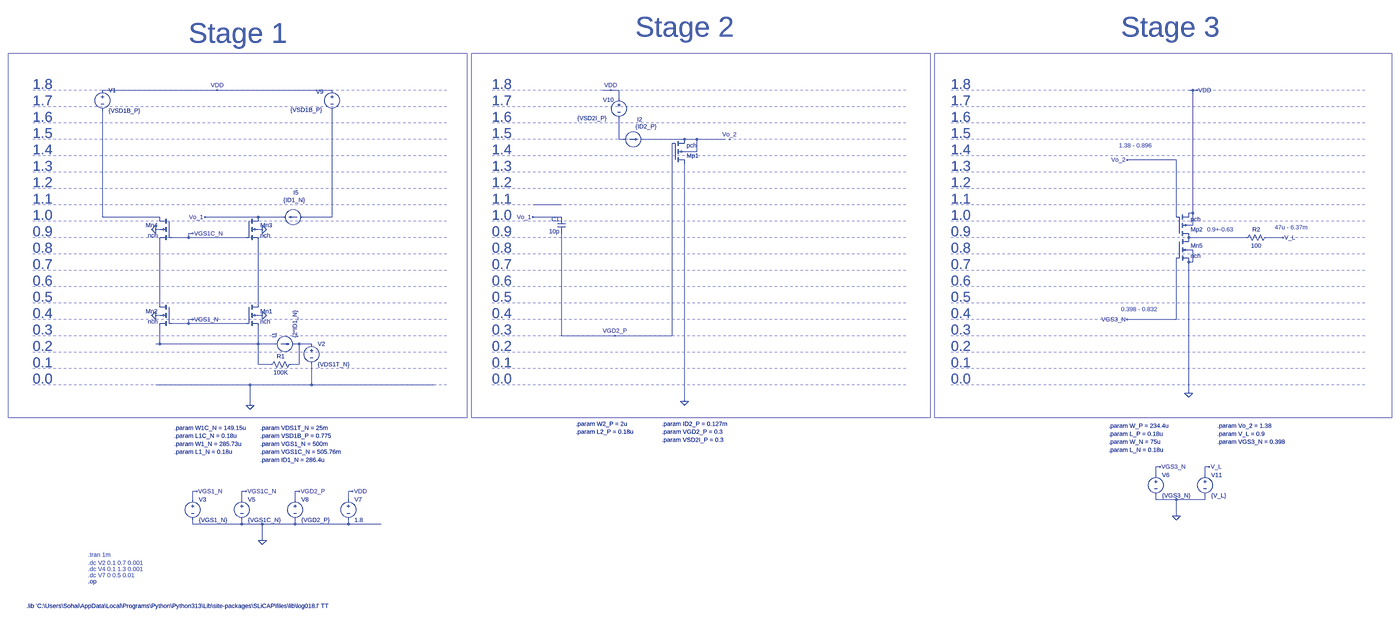
[diagram p0: schematic 1_2_final.asc, whole sheet]
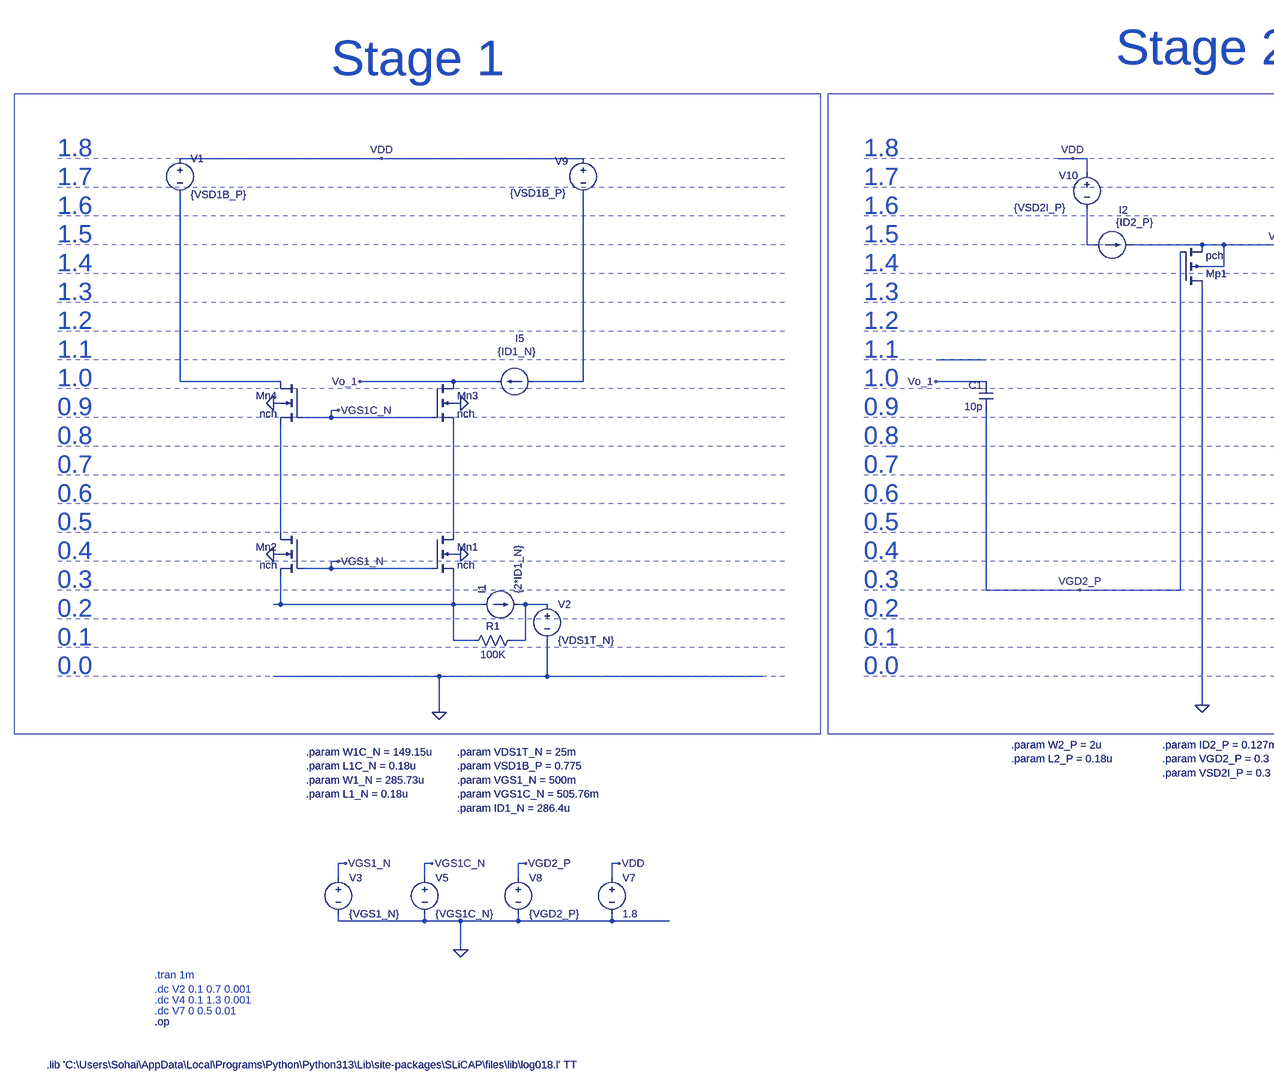
[diagram p1: schematic 1_2_final.asc, part, row 1 of 1, column 1 of 2]
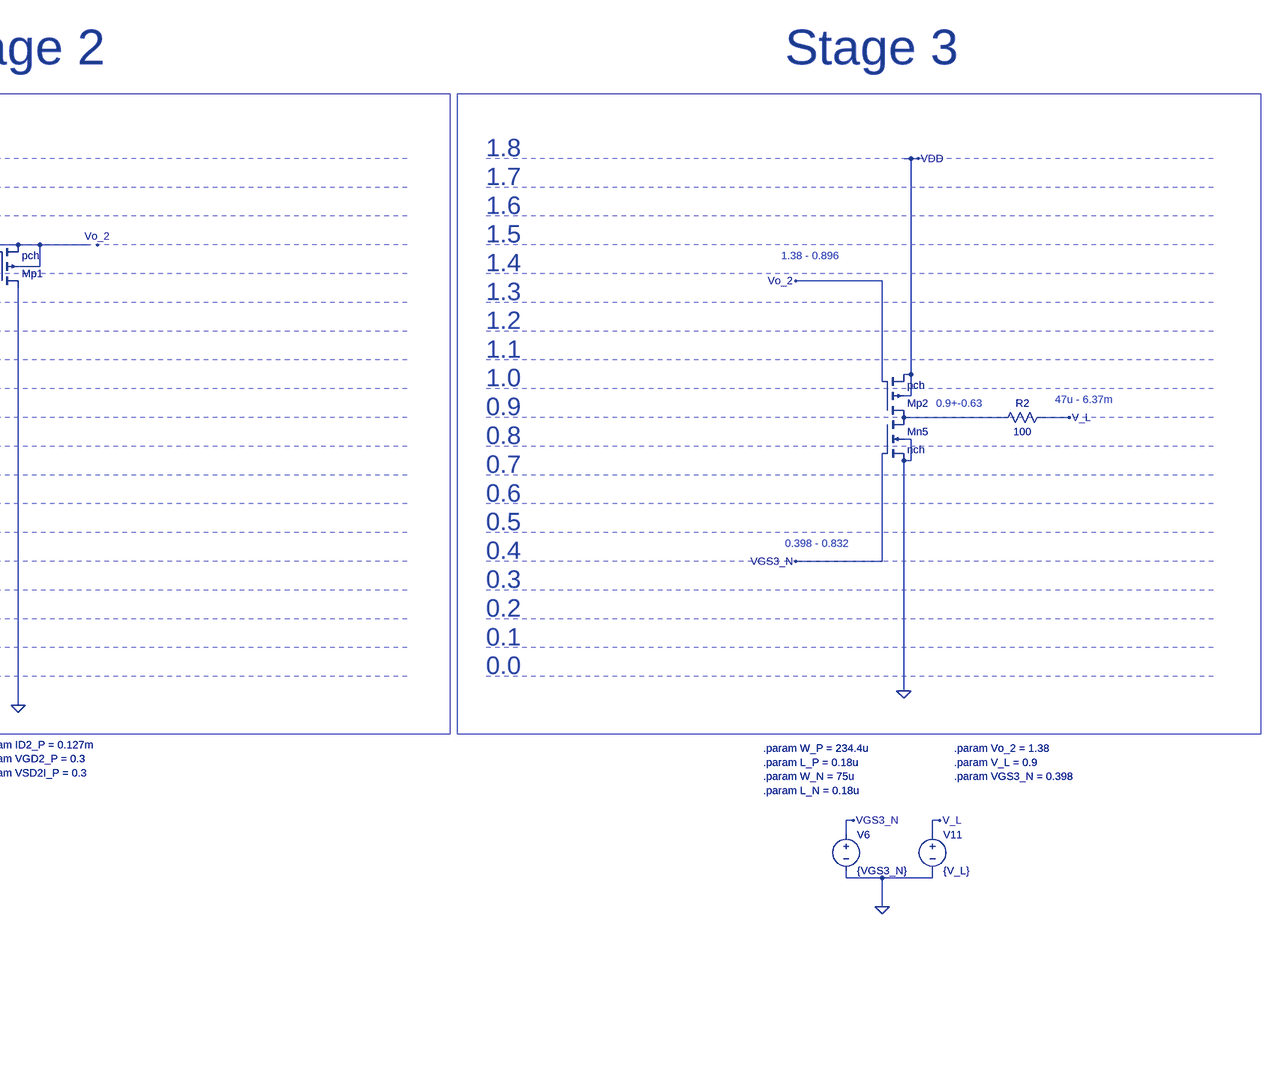
[diagram p2: schematic 1_2_final.asc, part, row 1 of 1, column 2 of 2]
1_2_final.asc, the LTspice schematic file:
Version 4
SHEET 1 2932 2468
WIRE -1664 -304 -2112 -304
WIRE -1216 -304 -1664 -304
WIRE -128 -304 -160 -304
WIRE -96 -304 -128 -304
WIRE 2144 -304 2128 -304
WIRE 2160 -304 2144 -304
WIRE -96 -272 -96 -304
WIRE -96 -112 -96 -192
WIRE -80 -112 -96 -112
WIRE 160 -112 0 -112
WIRE 208 -112 160 -112
WIRE 320 -112 208 -112
WIRE 208 -64 208 -112
WIRE 208 -64 160 -64
WIRE 2080 -32 1888 -32
WIRE -320 144 -432 144
WIRE 2144 176 2144 -304
WIRE 2144 176 2128 176
WIRE -2112 192 -2112 -224
WIRE -1888 192 -2112 192
WIRE -1504 192 -1712 192
WIRE -1408 192 -1504 192
WIRE -1216 192 -1216 -224
WIRE -1216 192 -1328 192
WIRE -320 192 -432 192
WIRE 2080 192 2080 -32
WIRE 2144 224 2144 176
WIRE 2144 224 2128 224
WIRE -1888 240 -1904 240
WIRE -1488 240 -1504 240
WIRE -1760 256 -1776 256
WIRE -1776 272 -1776 256
WIRE -1776 272 -1840 272
WIRE -1552 272 -1776 272
WIRE 2352 272 2128 272
WIRE 2496 272 2432 272
WIRE 2144 320 2128 320
WIRE 2144 368 2144 320
WIRE 2144 368 2128 368
WIRE -1888 528 -1888 288
WIRE -1504 528 -1504 288
WIRE -1888 576 -1904 576
WIRE -1488 576 -1504 576
WIRE -1760 592 -1776 592
WIRE 2080 592 2080 352
WIRE 2080 592 1888 592
WIRE -1776 608 -1776 592
WIRE -1776 608 -1840 608
WIRE -1552 608 -1776 608
WIRE -320 656 -320 256
WIRE -112 656 -320 656
WIRE 112 656 112 -96
WIRE 112 656 -112 656
WIRE -1888 688 -1888 624
WIRE -1888 688 -1904 688
WIRE -1504 688 -1504 624
WIRE -1504 688 -1888 688
WIRE -1440 688 -1504 688
WIRE -1344 688 -1360 688
WIRE -1296 688 -1344 688
WIRE -1504 768 -1504 688
WIRE -1456 768 -1504 768
WIRE -1344 768 -1344 688
WIRE -1344 768 -1376 768
WIRE -1536 848 -1904 848
WIRE -1296 848 -1296 768
WIRE -1296 848 -1536 848
WIRE -816 848 -1296 848
WIRE 2128 880 2128 368
WIRE 160 912 160 -16
WIRE -1536 928 -1536 848
WIRE 2016 1168 2000 1168
WIRE 2208 1168 2192 1168
WIRE 2000 1200 2000 1168
WIRE 2192 1200 2192 1168
WIRE -1744 1264 -1760 1264
WIRE -1552 1264 -1568 1264
WIRE -1344 1264 -1360 1264
WIRE -1136 1264 -1152 1264
WIRE -1760 1296 -1760 1264
WIRE -1568 1296 -1568 1264
WIRE -1360 1296 -1360 1264
WIRE -1152 1296 -1152 1264
WIRE 2000 1296 2000 1280
WIRE 2080 1296 2000 1296
WIRE 2192 1296 2192 1280
WIRE 2192 1296 2080 1296
WIRE 2080 1360 2080 1296
WIRE -1760 1392 -1760 1376
WIRE -1568 1392 -1568 1376
WIRE -1568 1392 -1760 1392
WIRE -1488 1392 -1568 1392
WIRE -1360 1392 -1360 1376
WIRE -1360 1392 -1488 1392
WIRE -1152 1392 -1152 1376
WIRE -1152 1392 -1360 1392
WIRE -1024 1392 -1152 1392
WIRE -1488 1456 -1488 1392
FLAG -1760 592 VGS1_N
FLAG -1760 256 VGS1C_N
FLAG -1536 928 0
FLAG -1488 1456 0
FLAG -1744 1264 VGS1_N
FLAG -1552 1264 VGS1C_N
FLAG -1136 1264 VDD
FLAG -1344 1264 VGD2_P
FLAG -1488 240 0
FLAG -1904 240 0
FLAG -1488 576 0
FLAG -1904 576 0
FLAG -128 -304 VDD
FLAG 160 912 0
FLAG -112 656 VGD2_P
FLAG -1664 -304 VDD
FLAG -1712 192 Vo_1
FLAG -432 192 Vo_1
FLAG 2080 1360 0
FLAG 2016 1168 VGS3_N
FLAG 2208 1168 V_L
FLAG 2496 272 V_L
FLAG 2160 -304 VDD
FLAG 2128 880 0
FLAG 1888 592 VGS3_N
FLAG 336 -112 Vo_2
FLAG 1888 -32 Vo_2
DATAFLAG -1632 272 ""
DATAFLAG -1632 608 ""
DATAFLAG 112 -112 ""
DATAFLAG 16 656 ""
DATAFLAG -2032 192 ""
DATAFLAG -1440 192 ""
DATAFLAG -1504 384 ""
DATAFLAG -1888 416 ""
DATAFLAG -1664 688 ""
DATAFLAG -1312 688 ""
DATAFLAG -1232 192 ""
DATAFLAG -400 192 ""
SYMBOL nmos4 -1552 528 R0
SYMATTR InstName Mn1
SYMATTR Value nch
SYMATTR Value2 l={L1_N} w={W1_N/4} m=4
SYMBOL nmos4 -1840 528 M0
SYMATTR InstName Mn2
SYMATTR Value nch
SYMATTR Value2 l={L1_N} w={W1_N/4} m=4
SYMBOL nmos4 -1552 192 R0
SYMATTR InstName Mn3
SYMATTR Value nch
SYMATTR Value2 l={L1C_N} w={W1C_N/4} m=4
SYMBOL nmos4 -1840 192 M0
SYMATTR InstName Mn4
SYMATTR Value nch
SYMATTR Value2 l={L1C_N} w={W1C_N/4} m=4
SYMBOL current -1440 688 R270
WINDOW 123 0 0 Left 0
WINDOW 39 0 0 Left 0
SYMATTR InstName I1
SYMATTR Value {2*ID1_N}
SYMBOL voltage -1296 672 R0
WINDOW 123 0 0 Left 0
WINDOW 39 0 0 Left 0
SYMATTR InstName V2
SYMATTR Value {VDS1T_N}
SYMBOL voltage -1760 1280 R0
WINDOW 123 0 0 Left 0
WINDOW 39 0 0 Left 0
SYMATTR InstName V3
SYMATTR Value {VGS1_N}
SYMBOL voltage -1568 1280 R0
WINDOW 123 0 0 Left 0
WINDOW 39 0 0 Left 0
SYMATTR InstName V5
SYMATTR Value {VGS1C_N}
SYMBOL voltage -1152 1280 R0
WINDOW 123 0 0 Left 0
WINDOW 39 0 0 Left 0
SYMATTR InstName V7
SYMATTR Value 1.8
SYMBOL voltage -1360 1280 R0
WINDOW 123 0 0 Left 0
WINDOW 39 0 0 Left 0
SYMATTR InstName V8
SYMATTR Value {VGD2_P}
SYMBOL current -1328 192 M270
WINDOW 123 0 0 Left 0
WINDOW 39 0 0 Left 0
WINDOW 0 96 39 VLeft 2
WINDOW 3 67 78 VLeft 2
SYMATTR InstName I5
SYMATTR Value {ID1_N}
SYMBOL voltage -2112 -320 R0
WINDOW 123 0 0 Left 0
WINDOW 39 0 0 Left 0
SYMATTR InstName V1
SYMATTR Value {VSD1B_P}
SYMBOL voltage -1216 -320 R0
WINDOW 123 0 0 Left 0
WINDOW 39 0 0 Left 0
WINDOW 0 -62 22 Left 2
WINDOW 3 -162 93 Left 2
SYMATTR InstName V9
SYMATTR Value {VSD1B_P}
SYMBOL pmos4 112 -16 M180
SYMATTR InstName Mp1
SYMATTR Value pch
SYMATTR Value2 l={L2_P} w={W2_P}
SYMBOL current -80 -112 R270
WINDOW 123 0 0 Left 0
WINDOW 39 0 0 Left 0
WINDOW 0 78 55 VRight 2
WINDOW 3 50 48 VRight 2
SYMATTR InstName I2
SYMATTR Value {ID2_P}
SYMBOL cap -304 256 R180
WINDOW 0 24 56 Left 2
WINDOW 3 24 8 Left 2
SYMATTR InstName C1
SYMATTR Value 10p
SYMBOL res -1360 752 R90
WINDOW 0 0 56 VBottom 2
WINDOW 3 32 56 VTop 2
SYMATTR InstName R1
SYMATTR Value 100K
SYMBOL voltage -96 -288 R0
WINDOW 123 0 0 Left 0
WINDOW 39 0 0 Left 0
WINDOW 0 -62 22 Left 2
WINDOW 3 -162 93 Left 2
SYMATTR InstName V10
SYMATTR Value {VSD2I_P}
SYMBOL voltage 2000 1184 R0
WINDOW 123 0 0 Left 0
WINDOW 39 0 0 Left 0
SYMATTR InstName V6
SYMATTR Value {VGS3_N}
SYMBOL voltage 2192 1184 R0
WINDOW 123 0 0 Left 0
WINDOW 39 0 0 Left 0
SYMATTR InstName V11
SYMATTR Value {V_L}
SYMBOL pmos4 2080 272 M180
SYMATTR InstName Mp2
SYMATTR Value pch
SYMATTR Value2 l={L_P} w={W_P/4} m=4
SYMBOL nmos4 2080 272 R0
SYMATTR InstName Mn5
SYMATTR Value nch
SYMATTR Value2 l={L_N} w={W_N/4} m=4
SYMBOL res 2448 256 R90
WINDOW 0 0 56 VBottom 2
WINDOW 3 32 56 VTop 2
SYMATTR InstName R2
SYMATTR Value 100
TEXT -2168 1512 Left 2 ;.tran 1m
TEXT -2168 1544 Left 2 ;.dc V2 0.1 0.7 0.001
TEXT -2168 1568 Left 2 ;.dc V4 0.1 1.3 0.001
TEXT -2168 1616 Left 2 !.op
TEXT -2168 1592 Left 2 ;.dc V7 0 0.5 0.01
TEXT -2384 -328 Left 5 ;1.8
TEXT -2384 -264 Left 5 ;1.7
TEXT -2384 -200 Left 5 ;1.6
TEXT -2384 -136 Left 5 ;1.5
TEXT -2384 -72 Left 5 ;1.4
TEXT -2384 -8 Left 5 ;1.3
TEXT -2384 56 Left 5 ;1.2
TEXT -2384 120 Left 5 ;1.1
TEXT -2384 184 Left 5 ;1.0
TEXT -2384 248 Left 5 ;0.9
TEXT -2384 312 Left 5 ;0.8
TEXT -2384 376 Left 5 ;0.7
TEXT -2384 440 Left 5 ;0.6
TEXT -2384 504 Left 5 ;0.5
TEXT -2384 568 Left 5 ;0.4
TEXT -2384 632 Left 5 ;0.3
TEXT -2384 696 Left 5 ;0.2
TEXT -2384 760 Left 5 ;0.1
TEXT -2384 824 Left 5 ;0.0
TEXT -592 -328 Left 5 ;1.8
TEXT -592 -264 Left 5 ;1.7
TEXT -592 -200 Left 5 ;1.6
TEXT -592 -136 Left 5 ;1.5
TEXT -592 -72 Left 5 ;1.4
TEXT -592 -8 Left 5 ;1.3
TEXT -592 56 Left 5 ;1.2
TEXT -592 120 Left 5 ;1.1
TEXT -592 184 Left 5 ;1.0
TEXT -592 248 Left 5 ;0.9
TEXT -592 312 Left 5 ;0.8
TEXT -592 376 Left 5 ;0.7
TEXT -592 440 Left 5 ;0.6
TEXT -592 504 Left 5 ;0.5
TEXT -592 568 Left 5 ;0.4
TEXT -592 632 Left 5 ;0.3
TEXT -592 696 Left 5 ;0.2
TEXT -592 760 Left 5 ;0.1
TEXT -592 824 Left 5 ;0.0
TEXT -2408 1712 Left 2 !.lib 'C:\\Users\\Sohai\\AppData\\Local\\Programs\\Python\\Python313\\Lib\\site-packages\\SLiCAP\\files\\lib\\log018.l' TT
TEXT -1832 1016 Left 2 !.param W1C_N = 149.15u\n.param L1C_N = 0.18u\n.param W1_N = 285.73u\n.param L1_N = 0.18u
TEXT -1496 1016 Left 2 !.param VDS1T_N = 25m\n.param VSD1B_P = 0.775\n.param VGS1_N = 500m\n.param VGS1C_N = 505.76m\n.param ID1_N = 286.4u
TEXT -264 1000 Left 2 !.param W2_P = 2u\n.param L2_P = 0.18u
TEXT 72 1000 Left 2 !.param ID2_P = 0.127m\n.param VGD2_P = 0.3\n.param VSD2I_P = 0.3
TEXT 1200 -328 Left 5 ;1.8
TEXT 1200 -264 Left 5 ;1.7
TEXT 1200 -200 Left 5 ;1.6
TEXT 1200 -136 Left 5 ;1.5
TEXT 1200 -72 Left 5 ;1.4
TEXT 1200 -8 Left 5 ;1.3
TEXT 1200 56 Left 5 ;1.2
TEXT 1200 120 Left 5 ;1.1
TEXT 1200 184 Left 5 ;1.0
TEXT 1200 248 Left 5 ;0.9
TEXT 1200 312 Left 5 ;0.8
TEXT 1200 376 Left 5 ;0.7
TEXT 1200 440 Left 5 ;0.6
TEXT 1200 504 Left 5 ;0.5
TEXT 1200 568 Left 5 ;0.4
TEXT 1200 632 Left 5 ;0.3
TEXT 1200 696 Left 5 ;0.2
TEXT 1200 760 Left 5 ;0.1
TEXT 1200 824 Left 5 ;0.0
TEXT 1816 1008 Left 2 !.param W_P = 234.4u\n.param L_P = 0.18u\n.param W_N = 75u\n.param L_N = 0.18u
TEXT 2240 1008 Left 2 !.param Vo_2 = 1.38\n.param V_L = 0.9\n.param VGS3_N = 0.398
TEXT 1856 -88 Left 2 ;1.38 - 0.896
TEXT 1864 552 Left 2 ;0.398 - 0.832
TEXT 2200 240 Left 2 ;0.9+-0.63
TEXT 2464 232 Left 2 ;47u - 6.37m
TEXT -1776 -528 Left 7 ;Stage 1
TEXT -32 -552 Left 7 ;Stage 2
TEXT 1864 -552 Left 7 ;Stage 3
LINE Normal -768 -304 -2384 -304 1
LINE Normal -768 -240 -2384 -240 1
LINE Normal -768 -176 -2384 -176 1
LINE Normal -768 -112 -2384 -112 1
LINE Normal -768 -48 -2384 -48 1
LINE Normal -768 16 -2384 16 1
LINE Normal -768 80 -2384 80 1
LINE Normal -768 144 -2384 144 1
LINE Normal -768 208 -2384 208 1
LINE Normal -768 272 -2384 272 1
LINE Normal -768 336 -2384 336 1
LINE Normal -768 400 -2384 400 1
LINE Normal -768 464 -2384 464 1
LINE Normal -768 528 -2384 528 1
LINE Normal -768 592 -2384 592 1
LINE Normal -768 656 -2384 656 1
LINE Normal -768 720 -2384 720 1
LINE Normal -768 784 -2384 784 1
LINE Normal -768 848 -2384 848 1
LINE Normal 1024 -304 -592 -304 1
LINE Normal 1024 -240 -592 -240 1
LINE Normal 1024 -176 -592 -176 1
LINE Normal 1024 -112 -592 -112 1
LINE Normal 1024 -48 -592 -48 1
LINE Normal 1024 16 -592 16 1
LINE Normal 1024 80 -592 80 1
LINE Normal 1024 144 -592 144 1
LINE Normal 1024 208 -592 208 1
LINE Normal 1024 272 -592 272 1
LINE Normal 1024 336 -592 336 1
LINE Normal 1024 400 -592 400 1
LINE Normal 1024 464 -592 464 1
LINE Normal 1024 528 -592 528 1
LINE Normal 1024 592 -592 592 1
LINE Normal 1024 656 -592 656 1
LINE Normal 1024 720 -592 720 1
LINE Normal 1024 784 -592 784 1
LINE Normal 1024 848 -592 848 1
LINE Normal 2816 -304 1200 -304 1
LINE Normal 2816 -240 1200 -240 1
LINE Normal 2816 -176 1200 -176 1
LINE Normal 2816 -112 1200 -112 1
LINE Normal 2816 -48 1200 -48 1
LINE Normal 2816 16 1200 16 1
LINE Normal 2816 80 1200 80 1
LINE Normal 2816 144 1200 144 1
LINE Normal 2816 208 1200 208 1
LINE Normal 2816 272 1200 272 1
LINE Normal 2816 336 1200 336 1
LINE Normal 2816 400 1200 400 1
LINE Normal 2816 464 1200 464 1
LINE Normal 2816 528 1200 528 1
LINE Normal 2816 592 1200 592 1
LINE Normal 2816 656 1200 656 1
LINE Normal 2816 720 1200 720 1
LINE Normal 2816 784 1200 784 1
LINE Normal 2816 848 1200 848 1
RECTANGLE Normal -688 976 -2480 -448
RECTANGLE Normal 1120 976 -672 -448
RECTANGLE Normal 2928 976 1136 -448

The netlist it stands for:
* 1_2_final.asc
Mn1 N008 VGS1_N N009 0 nch l={L1_N} w={W1_N/4} m=4
Mn2 N007 VGS1_N N009 0 nch l={L1_N} w={W1_N/4} m=4
Mn3 Vo_1 VGS1C_N N008 0 nch l={L1C_N} w={W1C_N/4} m=4
Mn4 N004 VGS1C_N N007 0 nch l={L1C_N} w={W1C_N/4} m=4
I1 N009 N010 {2*ID1_N}
V2 N010 0 {VDS1T_N}
V3 VGS1_N 0 {VGS1_N}
V5 VGS1C_N 0 {VGS1C_N}
V7 VDD 0 1.8
V8 VGD2_P 0 {VGD2_P}
I5 N005 Vo_1 {ID1_N}
V1 VDD N004 {VSD1B_P}
V9 VDD N005 {VSD1B_P}
Mp1 0 VGD2_P N002 N002 pch l={L2_P} w={W2_P}
I2 N001 N002 {ID2_P}
C1 VGD2_P Vo_1 10p
R1 N010 N009 100K
V10 VDD N001 {VSD2I_P}
V6 VGS3_N 0 {VGS3_N}
V11 V_L 0 {V_L}
Mp2 N006 Vo_2 VDD VDD pch l={L_P} w={W_P/4} m=4
Mn5 N006 VGS3_N 0 0 nch l={L_N} w={W_N/4} m=4
R2 V_L N006 100
.model NMOS NMOS
.model PMOS PMOS
.lib standard.mos
* .tran 1m
* .dc V2 0.1 0.7 0.001
* .dc V4 0.1 1.3 0.001
.op
* .dc V7 0 0.5 0.01
* 1.8
* 1.7
* 1.6
* 1.5
* 1.4
* 1.3
* 1.2
* 1.1
* 1.0
* 0.9
* 0.8
* 0.7
* 0.6
* 0.5
* 0.4
* 0.3
* 0.2
* 0.1
* 0.0
* 1.8
* 1.7
* 1.6
* 1.5
* 1.4
* 1.3
* 1.2
* 1.1
* 1.0
* 0.9
* 0.8
* 0.7
* 0.6
* 0.5
* 0.4
* 0.3
* 0.2
* 0.1
* 0.0
.lib 'C:\Users\Sohai\AppData\Local\Programs\Python\Python313\Lib\site-packages\SLiCAP\files\lib\log018.l' TT
.param W1C_N = 149.15u
.param L1C_N = 0.18u
.param W1_N = 285.73u
.param L1_N = 0.18u
.param VDS1T_N = 25m
.param VSD1B_P = 0.775
.param VGS1_N = 500m
.param VGS1C_N = 505.76m
.param ID1_N = 286.4u
.param W2_P = 2u
.param L2_P = 0.18u
.param ID2_P = 0.127m
.param VGD2_P = 0.3
.param VSD2I_P = 0.3
* 1.8
* 1.7
* 1.6
* 1.5
* 1.4
* 1.3
* 1.2
* 1.1
* 1.0
* 0.9
* 0.8
* 0.7
* 0.6
* 0.5
* 0.4
* 0.3
* 0.2
* 0.1
* 0.0
.param W_P = 234.4u
.param L_P = 0.18u
.param W_N = 75u
.param L_N = 0.18u
.param Vo_2 = 1.38
.param V_L = 0.9
.param VGS3_N = 0.398
* 1.38 - 0.896
* 0.398 - 0.832
* 0.9+-0.63
* 47u - 6.37m
* Stage 1
* Stage 2
* Stage 3
.backanno
.end